# Altium schematic sheet Amp_1watt_30MHz_2700MHz.SchDoc
size A; SheetNumber: 1; SheetTotal: 1
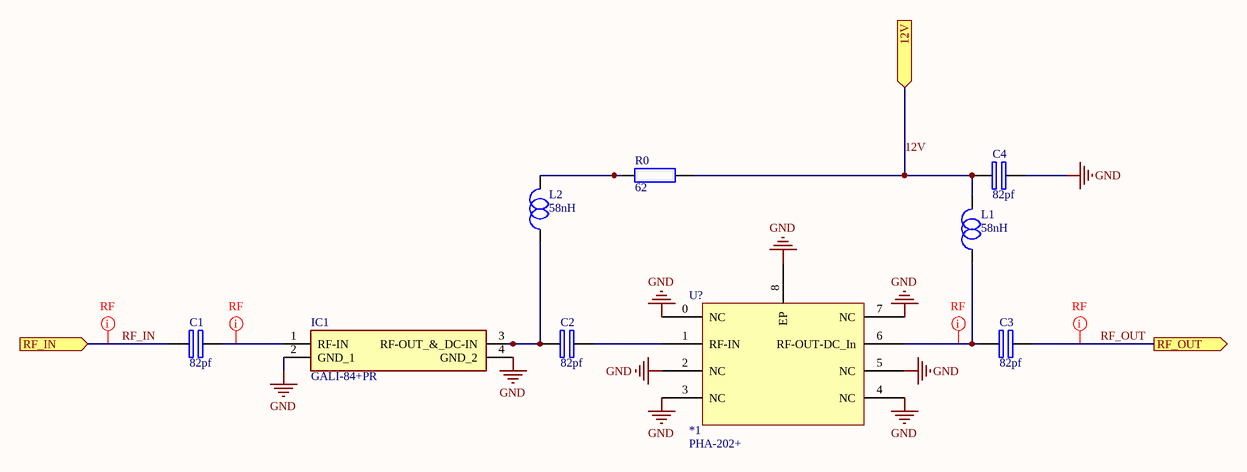
[diagram p0: Amp_1watt_30MHz_2700MHz.SchDoc]

## Parts
*1  PHA-202+  [PHA-202+]
C1  82pf  [CAPC0603X08N]
C2  82pf  [CAPC0603X08N]
C3  82pf  [CAPC0603X08M]
C4  82pf  [CAPC0603X08M]
IC1  GALI-84+PR  [GALI5]
L1  58nH  [INDC0805X142-2M]
L2  58nH  [INDC0805X142-2M]
R0  62  [RESC0603X04M]

## Ports
12V (in), RF_IN (in), RF_OUT (out)

## Nets
GND: *1.0(NC) *1.2(NC) *1.3(NC) *1.4(NC) *1.5(NC) *1.7(NC) *1.8(EP) C4.2 IC1.2(GND_1) IC1.4(GND_2)
12V: C4.1 L1.2 R0.2 ; port 12V
RF_IN: C1.1 ; port RF_IN
RF_OUT: C3.2 ; port RF_OUT
Net*1_1: *1.1(RF-IN) C2.2
Net*1_6: *1.6(RF-OUT-DC_In) C3.1 L1.1
NetC1_2: C1.2 IC1.1(RF-IN)
NetC2_1: C2.1 IC1.3(RF-OUT_&_DC-IN) L2.1
NetL2_2: L2.2 R0.1

## Layout directives
net class RF: Net*1_6, NetC1_2, RF_IN, RF_OUT

## Notes on the sheet
- (in symbol PHA-202+) U?

## Library data of the parts
C1-C4 = Capacitor2P-NP: The capacitor have 2PIN in AXIAL and SMD models. / all non-polar models include.; Created For: HiroNegarPars; Creator: Shahab Azmoodeh; Version: 1.0; Create Date: 2022/07/25; Must Assemble: *; PartNumber: *; Modified Date: 2022/07/25; Company: *; Value: 82pf
IC1 = GALI-84+PR: Integrated Circuit; Manufacturer_Name: Mini-Circuits; Datasheet Link: https://4donline.ihs.com/images/VipMasterIC/IC/MINI/MINIS11712/MINIS11712-1.pdf?hkey=EF798316E3902B6ED9A73243A3159BB0; Height: 1.6mm; Manufacturer_Part_Number: GALI-84+PR
L1 L2 = Inductor2P: generic smd and dip inductors; Created For: Hiro Negar; Creator: Milad Mohammadi Bidhandi; Version: 1.0; Create Date: 12.09.2022; Value: 58nH; Partnumber: *; Must Assemble: *; Modify Date: 13.09.2022; Company: *
R0 = Resistor2P: The resistors have 2PIN in AXIAL and SMD models. / All wattage include in.; Created For: HiroNegarPars; Creator: Shahab Azmoodeh; Version: 1.0; Create Date: 2022/07/24; Must Assemble: *; PartNumber: *; Modified Date: 2022/07/24; Company: *; Value: 62